# EAGLE schematic JCarlos e Renato (EAGLE 6.2)
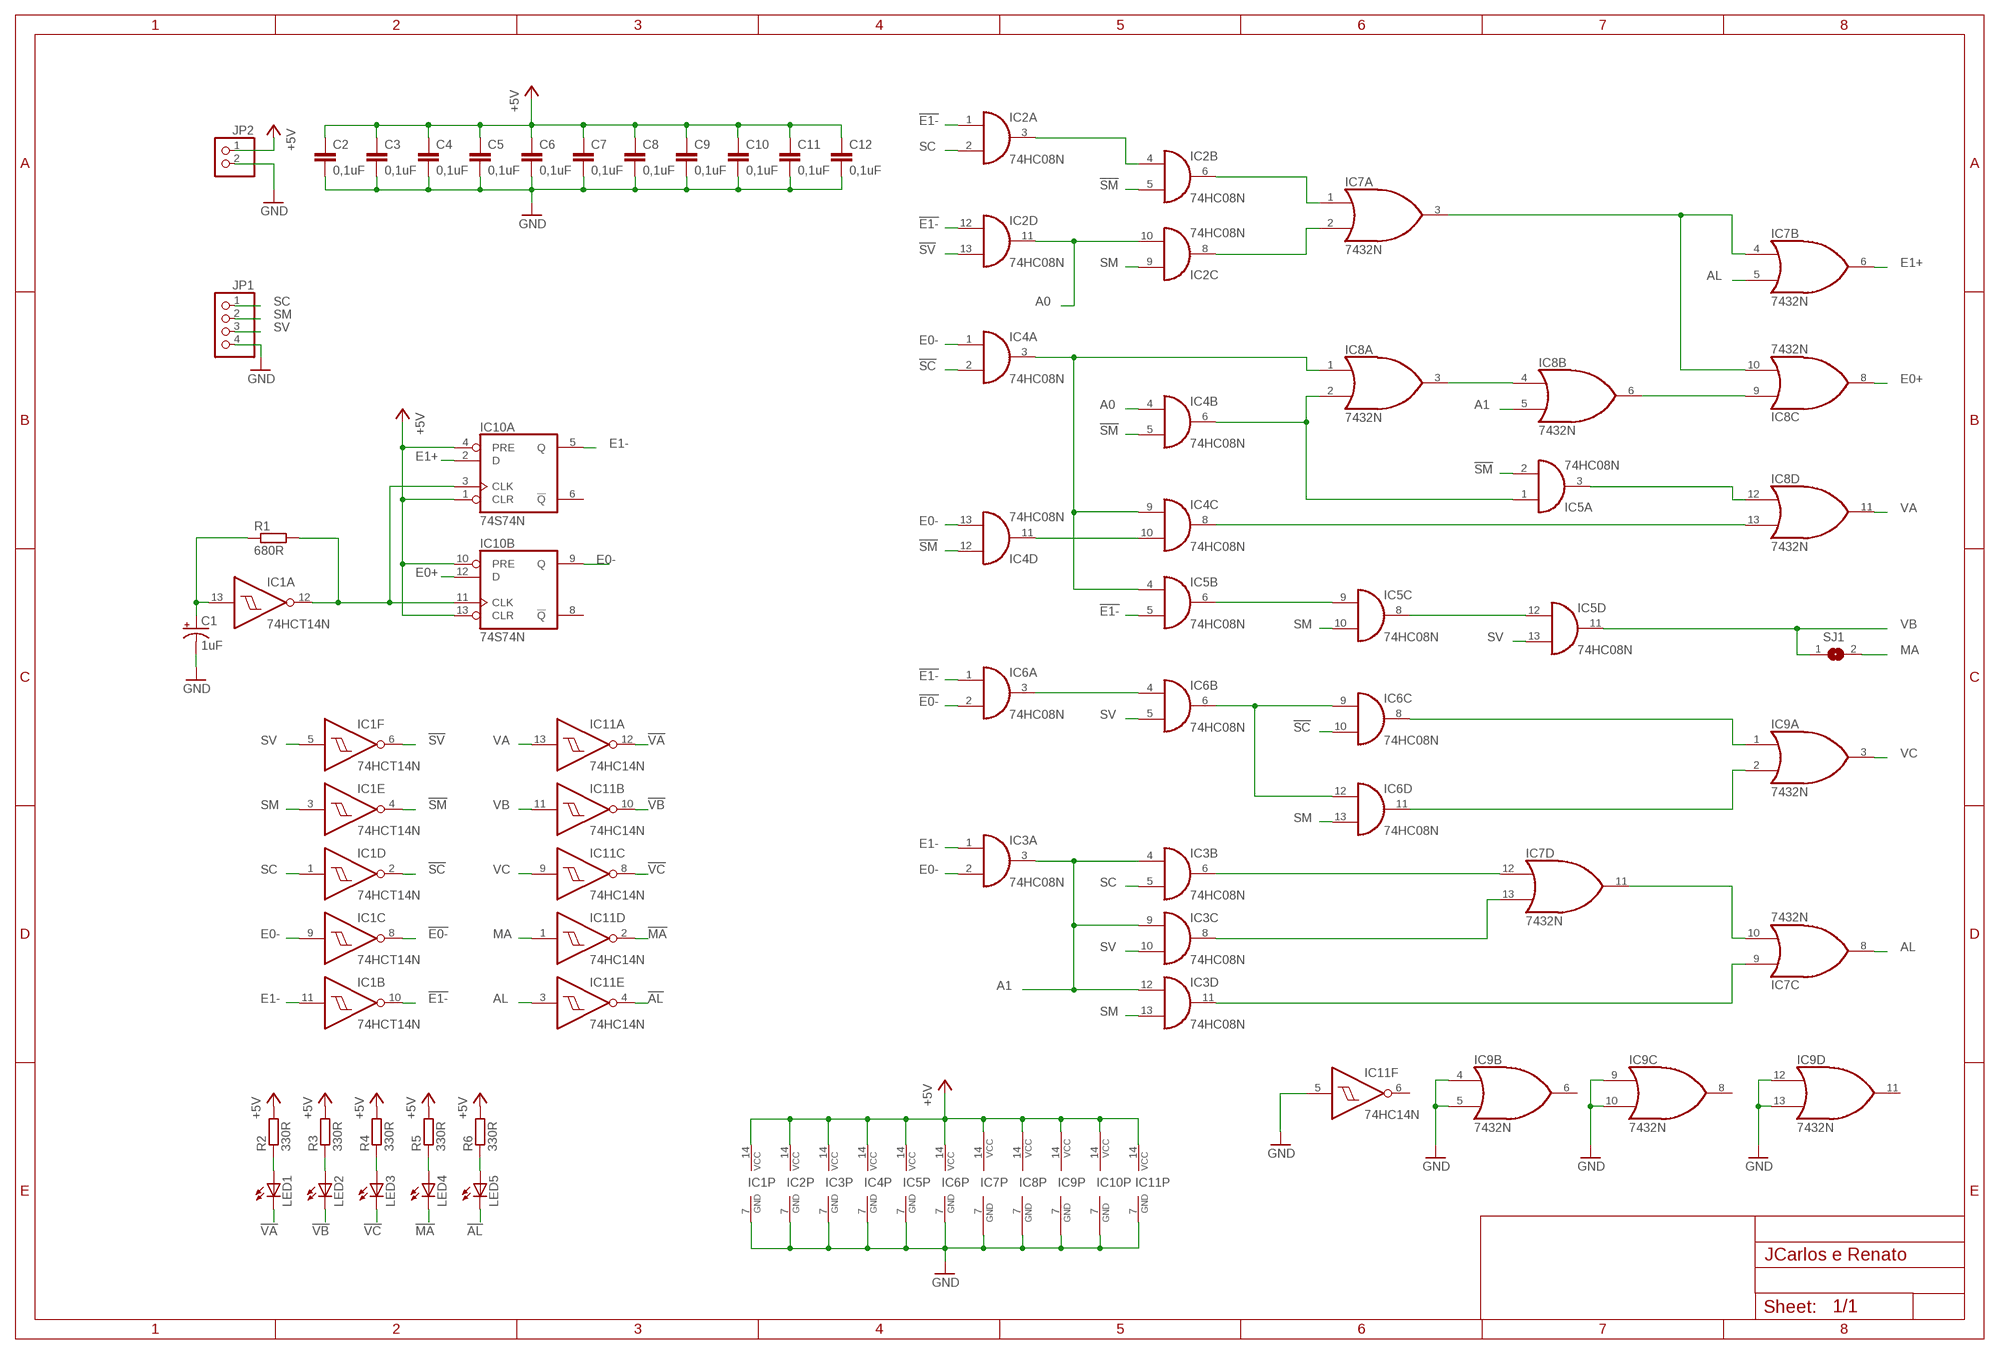
[diagram p0: schematic, sheet 1]

## Parts
C1  1uF  CPOL-USE5-6  [E5-6]
C2  0,1uF  C-EU050-025X075  [C050-025X075]
C3  0,1uF  C-EU050-025X075  [C050-025X075]
C4  0,1uF  C-EU050-025X075  [C050-025X075]
C5  0,1uF  C-EU050-025X075  [C050-025X075]
C6  0,1uF  C-EU050-025X075  [C050-025X075]
C7  0,1uF  C-EU050-025X075  [C050-025X075]
C8  0,1uF  C-EU050-025X075  [C050-025X075]
C9  0,1uF  C-EU050-025X075  [C050-025X075]
C10  0,1uF  C-EU050-025X075  [C050-025X075]
C11  0,1uF  C-EU050-025X075  [C050-025X075]
C12  0,1uF  C-EU050-025X075  [C050-025X075]
IC1  74HCT14N  [DIL14]
IC2  74HC08N  [DIL14]
IC3  74HC08N  [DIL14]
IC4  74HC08N  [DIL14]
IC5  74HC08N  [DIL14]
IC6  74HC08N  [DIL14]
IC7  7432N  [DIL14]
IC8  7432N  [DIL14]
IC9  7432N  [DIL14]
IC10  74S74N  [DIL14]
IC11  74HC14N  [DIL14]
JP1  PINHD-1X4  [1X04]
JP2  PINHD-1X2  [1X02]
LED1  LED5MM  [LED5MM]
LED2  LED5MM  [LED5MM]
LED3  LED5MM  [LED5MM]
LED4  LED5MM  [LED5MM]
LED5  LED5MM  [LED5MM]
R1  680R  R-EU_0204/5  [0204/5]
R2  330R  R-EU_0207/10  [0207/10]
R3  330R  R-EU_0207/10  [0207/10]
R4  330R  R-EU_0207/10  [0207/10]
R5  330R  R-EU_0207/10  [0207/10]
R6  330R  R-EU_0207/10  [0207/10]
SJ1  SJ  [SJ]

## Nets
!AL: IC11.4(E:O) LED5.K(C)
!E0-: IC1.8(C:O) IC6.2(A:I1)
!E1-: IC1.10(B:O) IC2.1(A:I0) IC2.12(D:I0) IC5.5(B:I1) IC6.1(A:I0)
!MA: IC11.2(D:O) LED4.K(C)
!SC: IC1.2(D:O) IC4.2(A:I1) IC6.10(C:I1)
!SM: IC1.4(E:O) IC2.5(B:I1) IC4.5(B:I1) IC4.12(D:I0) IC5.2(A:I1)
!SV: IC1.6(F:O) IC2.13(D:I1)
!VA: IC11.12(A:O) LED1.K(C)
!VB: IC11.10(B:O) LED2.K(C)
!VC: IC11.8(C:O) LED3.K(C)
+5V: C2.1 C3.1 C4.1 C5.1 C6.1 C7.1 C8.1 C9.1 C10.1 C11.1 C12.1 IC1.14(P:VCC) IC2.14(P:VCC) IC3.14(P:VCC) IC4.14(P:VCC) IC5.14(P:VCC) IC6.14(P:VCC) IC7.14(P:VCC) IC8.14(P:VCC) IC9.14(P:VCC) IC10.1(A:CLR) IC10.4(A:PRE) IC10.10(B:PRE) IC10.13(B:CLR) IC10.14(P:VCC) IC11.14(P:VCC) JP2.1 R2.2 R3.2 R4.2 R5.2 R6.2
A0: IC2.10(C:I1) IC2.11(D:O) IC4.4(B:I0)
A1: IC3.3(A:O) IC3.4(B:I0) IC3.9(C:I0) IC3.12(D:I0) IC8.5(B:I1)
AL: IC7.5(B:I1) IC7.8(C:O) IC11.3(E:I)
E0+: IC8.8(C:O) IC10.12(B:D)
E0-: IC1.9(C:I) IC3.2(A:I1) IC4.1(A:I0) IC4.13(D:I1) IC10.9(B:Q)
E1+: IC7.6(B:O) IC10.2(A:D)
E1-: IC1.11(B:I) IC3.1(A:I0) IC10.5(A:Q)
GND: C1.- C2.2 C3.2 C4.2 C5.2 C6.2 C7.2 C8.2 C9.2 C10.2 C11.2 C12.2 IC1.7(P:GND) IC2.7(P:GND) IC3.7(P:GND) IC4.7(P:GND) IC5.7(P:GND) IC6.7(P:GND) IC7.7(P:GND) IC8.7(P:GND) IC9.4(B:I0) IC9.5(B:I1) IC9.7(P:GND) IC9.9(C:I0) IC9.10(C:I1) IC9.12(D:I0) IC9.13(D:I1) IC10.7(P:GND) IC11.5(F:I) IC11.7(P:GND) JP1.4 JP2.2
MA: IC11.1(D:I) SJ1.2
N$1: IC5.6(B:O) IC5.9(C:I0)
N$2: IC7.3(A:O) IC7.4(B:I0) IC8.10(C:I1)
N$3: IC4.10(C:I1) IC4.11(D:O)
N$4: IC4.8(C:O) IC8.13(D:I1)
N$5: IC8.3(A:O) IC8.4(B:I0)
N$6: IC5.3(A:O) IC8.12(D:I0)
N$7: C1.+ IC1.13(A:I) R1.1
N$8: IC1.12(A:O) IC10.3(A:CLK) IC10.11(B:CLK) R1.2
N$9: IC8.6(B:O) IC8.9(C:I0)
N$10: IC4.3(A:O) IC4.9(C:I0) IC5.4(B:I0) IC8.1(A:I0)
N$11: IC5.8(C:O) IC5.12(D:I0)
N$12: IC4.6(B:O) IC5.1(A:I0) IC8.2(A:I1)
N$13: IC2.3(A:O) IC2.4(B:I0)
N$14: LED1.A R2.1
N$15: IC2.6(B:O) IC7.1(A:I0)
N$16: LED2.A R3.1
N$17: LED3.A R4.1
N$18: IC2.8(C:O) IC7.2(A:I1)
N$19: IC3.6(B:O) IC7.12(D:I0)
N$20: IC3.8(C:O) IC7.13(D:I1)
N$21: IC3.11(D:O) IC7.9(C:I0)
N$22: IC7.10(C:I1) IC7.11(D:O)
N$23: LED4.A R5.1
N$24: LED5.A R6.1
N$27: IC6.3(A:O) IC6.4(B:I0)
N$29: IC6.6(B:O) IC6.9(C:I0) IC6.12(D:I0)
N$32: IC6.8(C:O) IC9.1(A:I0)
N$33: IC6.11(D:O) IC9.2(A:I1)
SC: IC1.1(D:I) IC2.2(A:I1) IC3.5(B:I1) JP1.1
SM: IC1.3(E:I) IC2.9(C:I0) IC3.13(D:I1) IC5.10(C:I1) IC6.13(D:I1) JP1.2
SV: IC1.5(F:I) IC3.10(C:I1) IC5.13(D:I1) IC6.5(B:I1) JP1.3
VA: IC8.11(D:O) IC11.13(A:I)
VB: IC5.11(D:O) IC11.11(B:I) SJ1.1
VC: IC9.3(A:O) IC11.9(C:I)
Unconnected: IC9.6(B:O) IC9.8(C:O) IC9.11(D:O) IC10.6(A:!Q) IC10.8(B:!Q) IC11.6(F:O)

## Library data of the parts
C1 = rcl:CPOL-US: POLARIZED CAPACITOR, American symbol; E5-6: E5-6
C2-C12 = rcl:C-EU: CAPACITOR, European symbol
IC1 IC11 = 74xx-eu:74*14: Hex schmitt trigger INVERTER
IC2-IC6 = 74xx-eu:74*08: Quad 2-input AND gate
IC7-IC9 = 74xx-us:74*32: Quad 2-input OR gate
IC10 = 74xx-us:74*74: Dual D type positive edge triggered FLIP FLOP, preset and clear
JP1 = pinhead:PINHD-1X4: PIN HEADER
JP2 = pinhead:PINHD-1X2: PIN HEADER
LED1-LED5 = led:LED: LED OSRAM: - CHIPLED LG R971, LG N971, LY N971, LG Q971, LY Q971, LO R971, LY R971 LH N974, LH R974 LS Q976, LO Q976, LY Q976 LO Q996 - Hyper CHIPLED LW Q18S LB Q993, LB Q99A, LB R99A - SideLED LS A670, LO A670, LY A670, LG A670, LP A670 LB A673, LV A673, LT A673, LW A673 LH A674 LY A675 LS A676, LA A676, LO A676, LY A676, LW A676 LS A679, LY A679, LG A679 - Hyper Micro SIDELED® LS Y876, LA Y876, LO Y876, LY Y876 LT Y87S - SmartLED LW L88C, LW L88S LB L89C, LB L89S, LG L890 LS L89K, LO L89K, LY L89K LS L896, LA L896, LO L896, LY L896 - TOPLED LS T670, LO T670, LY T670, LG T670, LP T670 LSG T670, LSP T670, LSY T670, LOP T670, LYG T670 LG T671, LOG T671, LSG T671 LB T673, LV T673, LT T673, LW T673 LH T674 LS T676, LA T676, LO T676, LY T676, LB T676, LH T676, LSB T676, LW T676 LB T67C, LV T67C, LT T67C, LS T67K, LO T67K, LY T67K, LW E67C LS E67B, LA E67B, LO E67B, LY E67B, LB E67C, LV E67C, LT E67C LW T67C LS T679, LY T679, LG T679 LS T770, LO T770, LY T770, LG T770, LP T770 LB T773, LV T773, LT T773, LW T773 LH T774 LS E675, LA E675, LY E675, LS T675 LS T776, LA T776, LO T776, LY T776, LB T776 LHGB T686 LT T68C, LB T68C - Hyper Mini TOPLED® LB M676 - Mini TOPLED Santana® LG M470 LS M47K, LO M47K, LY M47K Source: http://www.osram.convergy.de LUXEON: - LUMILED® LXK2-PW12-R00, LXK2-PW12-S00, LXK2-PW14-U00, LXK2-PW14-V00 LXK2-PM12-R00, LXK2-PM12-S00, LXK2-PM14-U00 LXK2-PE12-Q00, LXK2-PE12-R00, LXK2-PE12-S00, LXK2-PE14-T00, LXK2-PE14-U00 LXK2-PB12-K00, LXK2-PB12-L00, LXK2-PB12-M00, LXK2-PB14-N00, LXK2-PB14-P00, LXK2-PB14-Q00 LXK2-PR12-L00, LXK2-PR12-M00, LXK2-PR14-Q00, LXK2-PR14-R00 LXK2-PD12-Q00, LXK2-PD12-R00, LXK2-PD12-S00 LXK2-PH12-R00, LXK2-PH12-S00 LXK2-PL12-P00, LXK2-PL12-Q00, LXK2-PL12-R00 Source: www.luxeon.com KINGBRIGHT: KA-3528ASYC Source: www.kingbright.com
R1-R6 = rcl:R-EU_: RESISTOR, European symbol
SJ1 = jumper:SJ: SMD solder JUMPER